# Altium schematic sheet MCU.SchDoc
size A4
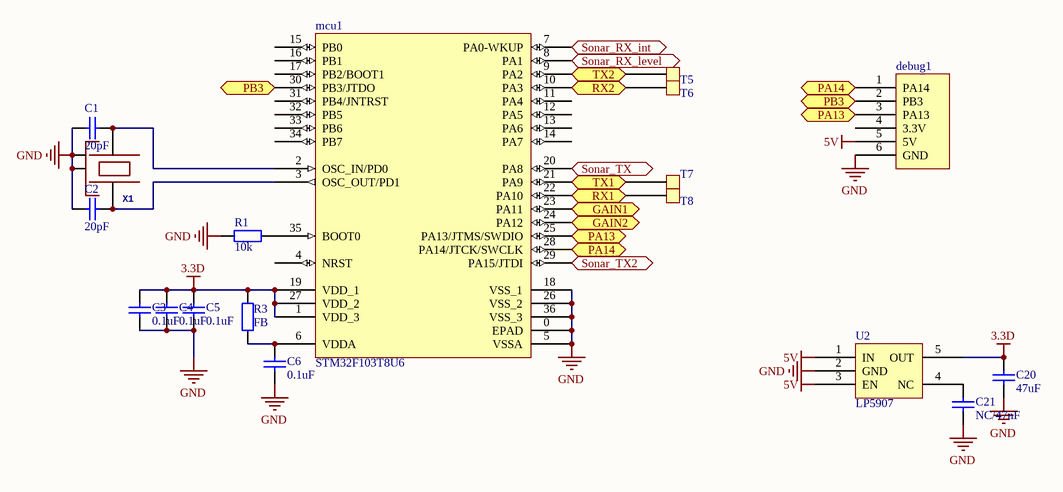
[diagram p0: MCU.SchDoc]

## Parts
C1  value 20pF  [0402]  (hidden comment: Cap)
C2  value 20pF  [0402]  (hidden comment: Cap)
C3  value 0.1uF  [0402]  (hidden comment: Cap)
C4  value 0.1uF  [0402]  (hidden comment: Cap)
C5  value 0.1uF  [0402]  (hidden comment: Cap)
C6  value 0.1uF  [0402]  (hidden comment: Cap)
C20  value 47uF  [0805]  (hidden comment: Cap)
C21  value NC/47nF  [0402]  (hidden comment: Cap)
debug1  debug  [WFRSM125]  (value not drawn)
mcu1  STM32F103T8U6  [VFQN36_N]
R1  value 10k  [0402]  (hidden comment: Res2)
R3  value FB  [0402]  (hidden comment: Res2)
T5  TestPad  [TestPad - 1mm]  (value not drawn)
T6  TestPad  [TestPad - 1mm]  (value not drawn)
T7  TestPad  [TestPad - 1mm]  (value not drawn)
T8  TestPad  [TestPad - 1mm]  (value not drawn)
U2  LP5907  [SOT23-5]
X1  24.000 KHz 3.2x2.5mm 8-10pf  [OSCILLATOR-3.2X2.5]  (value not drawn)

## Ports
GAIN1, GAIN2, PA13, PA14, PB3, RX1, RX2, Sonar_RX_int, Sonar_RX_level, Sonar_TX, Sonar_TX2, TX1, TX2

## Nets
3.3D: C3.2 C4.2 C5.2 C20.1 mcu1.1(VDD_3) mcu1.19(VDD_1) mcu1.27(VDD_2) R3.1 U2.5(OUT)
5V: debug1.5(5V) U2.1(IN) U2.3(EN)
GND: C1.1 C2.1 C3.1 C4.1 C5.1 C6.1 C20.2 C21.2 debug1.6(GND) mcu1.0(EPAD) mcu1.5(VSSA) mcu1.18(VSS_1) mcu1.26(VSS_2) mcu1.36(VSS_3) R1.2 U2.2(GND) X1.2(NC_2) X1.4(NC_4)
GAIN1: mcu1.23(PA11) ; port GAIN1
GAIN2: mcu1.24(PA12) ; port GAIN2
PA13: debug1.3(PA13) mcu1.25(PA13/JTMS/SWDIO) ; port PA13
PA14: debug1.1(PA14) mcu1.28(PA14/JTCK/SWCLK) ; port PA14
PB3: debug1.2(PB3) mcu1.30(PB3/JTDO) ; port PB3
RX1: mcu1.22(PA10) T8.1 ; port RX1
RX2: mcu1.10(PA3) T6.1 ; port RX2
Sonar_RX_int: mcu1.7(PA0-WKUP) ; port Sonar_RX_int
Sonar_RX_level: mcu1.8(PA1) ; port Sonar_RX_level
Sonar_TX: mcu1.20(PA8) ; port Sonar_TX
Sonar_TX2: mcu1.29(PA15/JTDI) ; port Sonar_TX2
TX1: mcu1.21(PA9) T7.1 ; port TX1
TX2: mcu1.9(PA2) T5.1 ; port TX2
NetC1_2: C1.2 mcu1.2(OSC_IN/PD0) X1.1
NetC2_2: C2.2 mcu1.3(OSC_OUT/PD1) X1.3
NetC6_2: C6.2 mcu1.6(VDDA) R3.2
NetC21_1: C21.1 U2.4(NC)
Netmcu1_35: mcu1.35(BOOT0) R1.1

Not connected (* = marked no-connect by the designer): debug1 4(3.3V); mcu1 4(NRST) 11(PA4) 12(PA5) 13(PA6) 14(PA7) 15(PB0) 16(PB1) 17(PB2/BOOT1) 31(PB4/JNTRST) 32(PB5) 33(PB6) 34(PB7)

## Library data of the parts
C1-C6 C20 C21 = Cap: Capacitor; Published: 8-Jun-2000; LatestRevisionDate: 17-Jul-2002; LatestRevisionNote: Re-released for DXP Platform.; PackageReference: RAD-0.3; Publisher: Altium Limited; PackageDescription: Radial Cap, Thru-Hole; 2 Leads; 0.3 in Pin Spacing
mcu1 = STM32F103T8U6: STM32 ARM-based 32-bit MCU with 64 Kbytes Flash, 36-pin VFQFPN, Industrial Temperature; Published: *; DatasheetVersion: *; PackageVersion: *; PackageReference: *; Publisher: *; PackageDescription: *; ComponentLink1Description: *; ComponentLink1URL: *; ComponentLink2Description: *; ComponentLink2URL: *
R1 R3 = Res2: Resistor; Published: 8-Jun-2000; LatestRevisionDate: 17-Jul-2002; LatestRevisionNote: Re-released for DXP Platform.; PackageReference: AXIAL-0.4; Publisher: Altium Limited; PackageDescription: Axial Device, Thru-Hole; 2 Leads; 0.4 in Pin Spacing
X1 = OSCILLATOR-3.2X2.5: Crystal Oscillator in 3.2x2.5 SMD